# EAGLE design nrf52840_holyiot_18010_breakout_rev_1 (EAGLE 9.2.1)
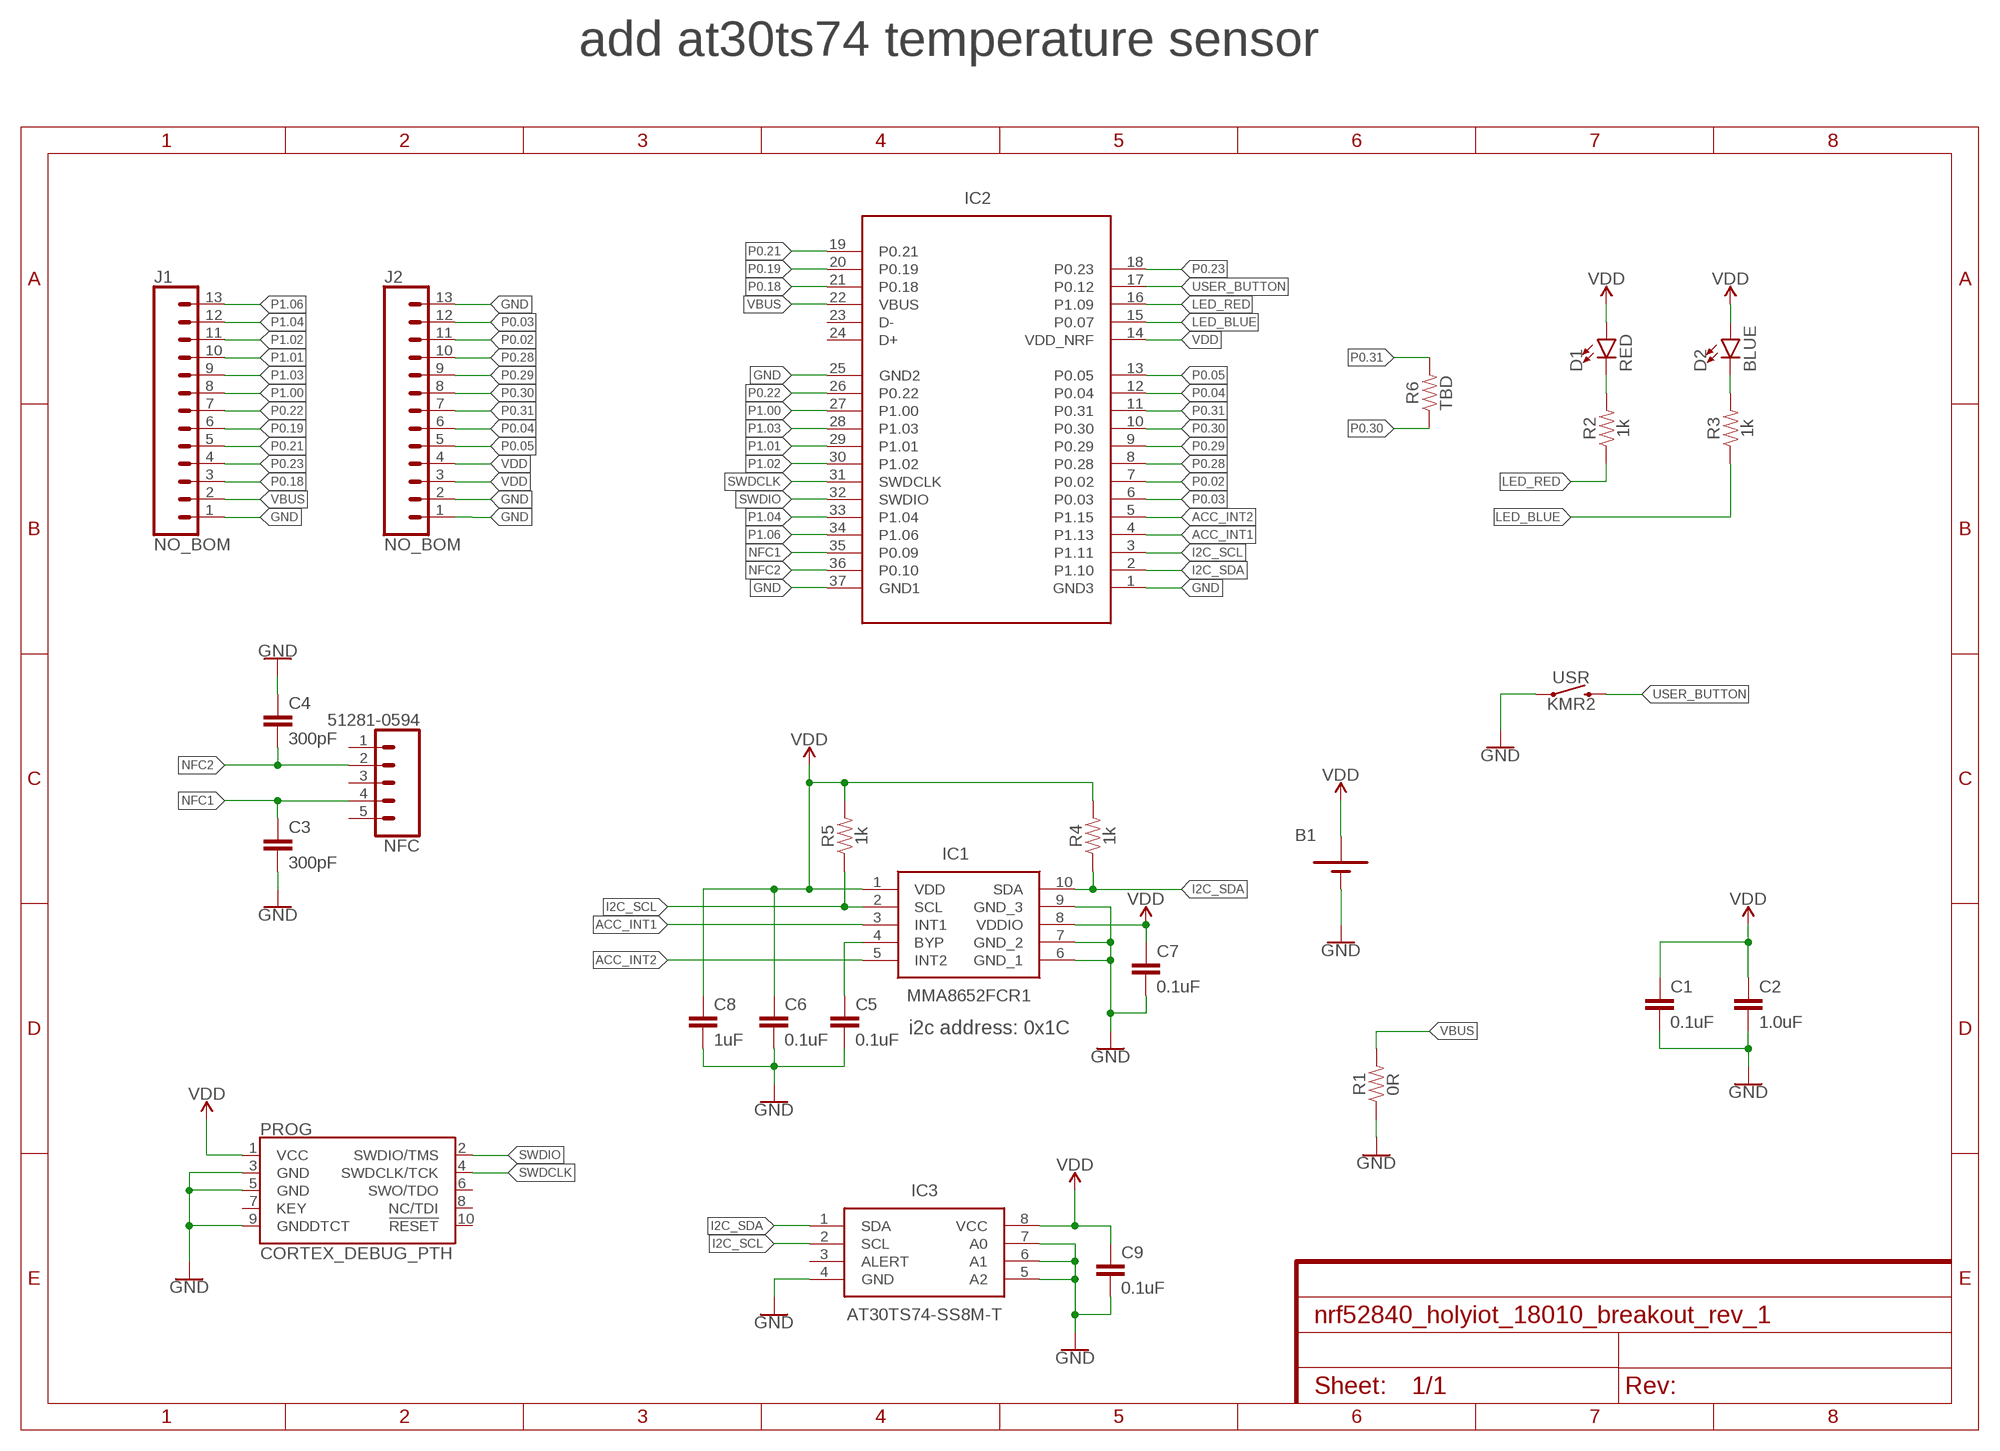
[diagram p0: schematic, sheet 1]

## Parts
B1  BATTERY-BU2032  [BU2032SM-HD-G]
C1  0.1uF  CAP-6.3V-20%-0402  [C0402]
C2  1.0uF  CAP-6.3V-20%-0603  [C0603]
C3  300pF  CAP-6.3V-20%-0402  [C0402]
C4  300pF  CAP-6.3V-20%-0402  [C0402]
C5  0.1uF  CAP-6.3V-20%-0402  [C0402]
C6  0.1uF  CAP-6.3V-20%-0402  [C0402]
C7  0.1uF  CAP-6.3V-20%-0402  [C0402]
C8  1uF  CAP-6.3V-20%-0402  [C0402]
C9  0.1uF  CAP-6.3V-20%-0402  [C0402]
D1  RED  LED0603  [LED-0603]
D2  BLUE  LED0603  [LED-0603]
IC1  MMA8652FCR1  [SON40P200X200X100-10N]
IC2  HOLYIOT_18010  [HOLYIOT_18010_REDUCED]
IC3  AT30TS74-SS8M-T  [SOIC127P600X175-8N]
J1  NO_BOM  CONN_13NO_SILK  [1X13_NO_SILK]
J2  NO_BOM  CONN_13NO_SILK  [1X13_NO_SILK]
NFC  51281-0594  [51281-0594]
PROG  CORTEX_DEBUG_PTH  [2X5-PTH-1.27MM]
R1  0R  RES-0.063W-5%-0402  [R0402]
R2  1k  RES-0.063W-5%-0402  [R0402]
R3  1k  RES-0.063W-5%-0402  [R0402]
R4  1k  RES-0.063W-5%-0402  [R0402]
R5  1k  RES-0.063W-5%-0402  [R0402]
R6  TBD  RES-0.063W-1%-0402  [R0402]
USR  KMR2  [TACTILE_SWITCH_SMD_4.6X2.8MM]

## Nets
ACC_INT1: IC1.3(INT1) IC2.4(P1.13)
ACC_INT2: IC1.5(INT2) IC2.5(P1.15)
GND: B1.2(-) C1.2 C2.2 C3.2 C4.1 C5.2 C6.2 C7.2 C8.2 C9.2 IC1.6(GND_1) IC1.7(GND_2) IC1.9(GND_3) IC2.1(GND3) IC2.25(GND2) IC2.37(GND1) IC3.4(GND) IC3.5(A2) IC3.6(A1) IC3.7(A0) J1.1 J2.1 J2.2 J2.13 PROG.3(GND) PROG.5(GND) PROG.9(GNDDTCT) R1.1 USR.1 USR.2
I2C_SCL: IC1.2(SCL) IC2.3(P1.11) IC3.2(SCL) R5.1
I2C_SDA: IC1.10(SDA) IC2.2(P1.10) IC3.1(SDA) R4.1
LED_BLUE: IC2.15(P0.07) R3.1
LED_RED: IC2.16(P1.09) R2.1
N$1: D1.C R2.2
N$2: D2.C R3.2
N$3: C5.1 IC1.4(BYP)
NFC1: C3.1 IC2.35(P0.09) NFC.4
NFC2: C4.2 IC2.36(P0.10) NFC.2
P0.02: IC2.7(P0.02) J2.11
P0.03: IC2.6(P0.03) J2.12
P0.04: IC2.12(P0.04) J2.6
P0.05: IC2.13(P0.05) J2.5
P0.18: IC2.21(P0.18) J1.3
P0.19: IC2.20(P0.19) J1.6
P0.21: IC2.19(P0.21) J1.5
P0.22: IC2.26(P0.22) J1.7
P0.23: IC2.18(P0.23) J1.4
P0.28: IC2.8(P0.28) J2.10
P0.29: IC2.9(P0.29) J2.9
P0.30: IC2.10(P0.30) J2.8 R6.1
P0.31: IC2.11(P0.31) J2.7 R6.2
P1.00: IC2.27(P1.00) J1.8
P1.01: IC2.29(P1.01) J1.10
P1.02: IC2.30(P1.02) J1.11
P1.03: IC2.28(P1.03) J1.9
P1.04: IC2.33(P1.04) J1.12
P1.06: IC2.34(P1.06) J1.13
SWDCLK: IC2.31(SWDCLK) PROG.4(SWDCLK/TCK)
SWDIO: IC2.32(SWDIO) PROG.2(SWDIO/TMS)
USER_BUTTON: IC2.17(P0.12) USR.3 USR.4
VBUS: IC2.22(VBUS) J1.2 R1.2
VDD: B1.1(+) C1.1 C2.1 C6.1 C7.1 C8.1 C9.1 D1.A D2.A IC1.1(VDD) IC1.8(VDDIO) IC2.14(VDD_NRF) IC3.8(VCC) J2.3 J2.4 PROG.1(VCC) R4.2 R5.2
Unconnected: IC2.23(D-) IC2.24(D+) IC3.3(ALERT) NFC.1 NFC.3 NFC.5 PROG.6(SWO/TDO) PROG.7(KEY) PROG.8(NC/TDI) PROG.10(!RESET)

## Notes on the sheet
- add at30ts74 temperature sensor
- i2c address: 0x1C

## Library data of the parts
B1 = Inventas-Misc:BATTERY: 596: https://www.digikey.com/product-detail/en/keystone-electronics/596/36-596-ND/2137852 590: https://www.digikey.com/product-detail/en/keystone-electronics/590/36-590-ND/2137886 5230: https://www.digikey.com/product-detail/en/keystone-electronics/5230/36-5230-ND/643095; MANUFACTURER_NAME: MPD; MANUFACTURER_PART_NUMBER: BU2032SM-HD-G
C1-C9 = Inventas-Passives:CAP-6.3V-20%: Ceramic capacitors
D1 D2 = inventas_LEDs:LED: LED (Generic) Standard schematic elements and footprints for 5mm, 3mm, 1206, and 0603 sized LEDs. Generic LEDs with no color specified.
IC1 = Inventas-IC:MMA8652FCR1: NXP MMA8652FCR1, 3-Axis Accelerometer, 2 g, 4 g, 8 g, 1.95 3.6 V, Serial-I2C, DFN 10-Pin Source: Datasheet <https://cache.freescale.com/files/sensors/doc/data_sheet/MMA8652FC.pdf>; ARROW_PART_NUMBER: MMA8652FCR1; ARROW_PRICE-STOCK: http://uk.rs-online.com/web/p/products/8016889P; DESCRIPTION: NXP MMA8652FCR1, 3-Axis Accelerometer, 2 g, 4 g, 8 g, 1.95 3.6 V, Serial-I2C, DFN 10-Pin; HEIGHT: 1mm; MANUFACTURER_NAME: NXP; MANUFACTURER_PART_NUMBER: MMA8652FCR1; RS_PART_NUMBER: 8016889P; RS_PRICE-STOCK: http://uk.rs-online.com/web/p/products/8016889P
IC2 = Inventas-IC:HOLYIOT_18010; MANUFACTURER_NAME: Holyiot; MANUFACTURER_PART_NUMBER: 18010
IC3 = Inventas-IC:AT30TS74; MANUFACTURER_NAME: microchip; MANUFACTURER_PART_NUMBER: AT30TS74-SS8M-T
J1 J2 = Inventas-Connectors:CONN_13: Multi connection point. Often used as Generic Header-pin footprint for 0.1 inch spaced/style header connections On any of the 0.1 inch spaced packages, you can populate with these: Break Away Headers - Straight <https://www.sparkfun.com/products/116> (PRT-00116) Break Away Male Headers - Right Angle <https://www.sparkfun.com/products/553> (PRT-00553) Female Headers <https://www.sparkfun.com/products/115> (PRT-00115) Break Away Headers - Machine Pin <https://www.sparkfun.com/products/117> (PRT-00117) Break Away Female Headers - Swiss Machine Pin <https://www.sparkfun.com/products/743> (PRT-00743) For SCREWTERMINALS and SPRING TERMINALS visit here: Screw Terimnals on SparkFun.com <https://www.sparkfun.com/search/results?term=Screw+Terminals> (5mm/3.5mm/2.54mm spacing) This device is also useful as a general connection point to wire up your design to another part of your project. Our various solder wires solder well into these plated through hole pads. Hook-Up Wire - Assortment (Stranded, 22 AWG) <https://www.sparkfun.com/products/11375> (PRT-11375) Hook-Up Wire - Assortment (Solid Core, 22 AWG) <https://www.sparkfun.com/products/11367> (PRT-11367) View the entire wire category on our website here <https://www.sparkfun.com/categories/141> Special notes: Molex polarized connector foot print use with SKU : PRT-08231 with associated crimp pins and housings. 1MM SMD Version SKU: PRT-10208 NOTES ON THE VARIANTS LOCK and LOCK_LONGPADS... This footprint was designed to help hold the alignment of a through-hole component (i.e. 6-pin header) while soldering it into place. You may notice that each hole has been shifted either up or down by 0.005 of an inch from it's more standard position (which is a perfectly straight line). This slight alteration caused the pins (the squares in the middle) to touch the edges of the holes. Because they are alternating, it causes a "brace" to hold the component in place. 0.005 has proven to be the perfect amount of "off-center" position when using our standard breakaway headers. Although looks a little odd when you look at the bare footprint, once you have a header in there, the alteration is very hard to notice. Also,if you push a header all the way into place, it is covered up entirely on the bottom side.
NFC = Inventas-Connectors:51281-0594: FFC & FPC Connectors 0.5 FPC Non-ZIF 5Ckt Dual Contact Source: Datasheet <http://www.molex.com/pdm_docs/sd/512810594_sd.pdf>; DESCRIPTION: FFC & FPC Connectors 0.5 FPC Non-ZIF 5Ckt Dual Contact; HEIGHT: mm; MANUFACTURER_NAME: Molex; MANUFACTURER_PART_NUMBER: 51281-0594; SUPPLIER_NAME: RS
PROG = Inventas-Connectors:CORTEX_DEBUG: Cortex Debug Connector - 10 pin Supports JTAG debug, Serial Wire debug, and Serial Wire Viewer. PTH and SMD connector options available. General Connector Information <http://infocenter.arm.com/help/topic/com.arm.doc.faqs/attached/13634/cortex_debug_connectors.pdf> Products: PTH Connector <http://www.digikey.com/product-detail/en/cnc-tech/3220-10-0100-00/1175-1627-ND/3883661> -via Digi-Key SparkFun PSoc <https://www.sparkfun.com/products/13229> SparkFun T <https://www.sparkfun.com/products/13810>
R1-R5 = Inventas-Passives:RES-0.063W-5%-: Generic Resistor Package
R6 = Inventas-Passives:RES-0.063W-1%-: Generic Resistor Package
USR = Inventas-Buttons:KMR2; MANUFACTURER_NAME: C&K; MANUFACTURER_PART_NUMBER: KMR211GLFS

## Board
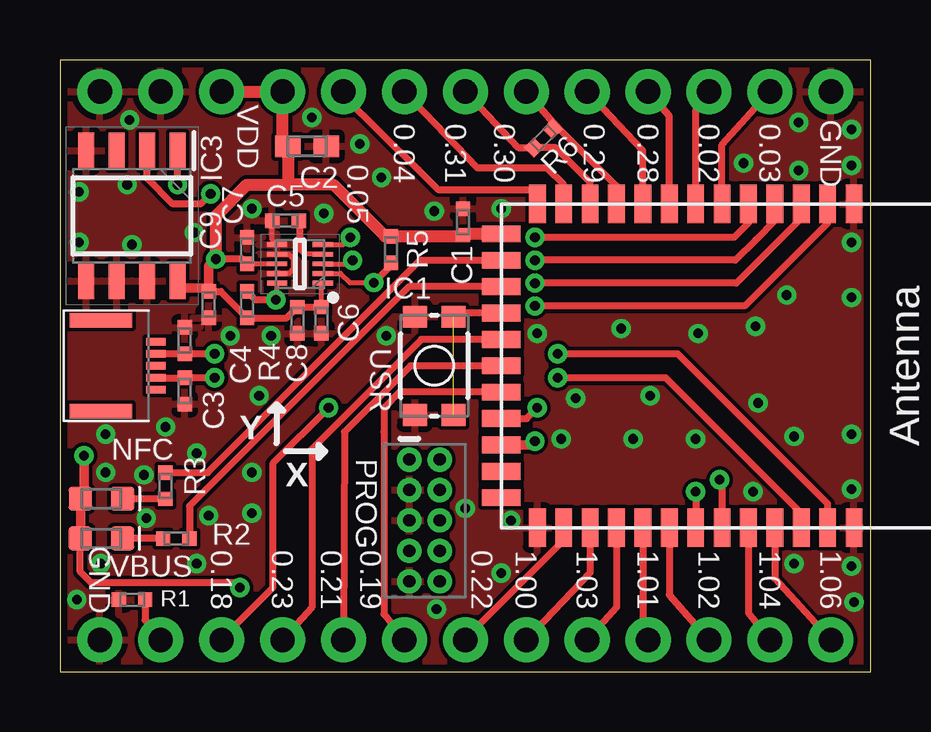
[diagram p1: board, top side]
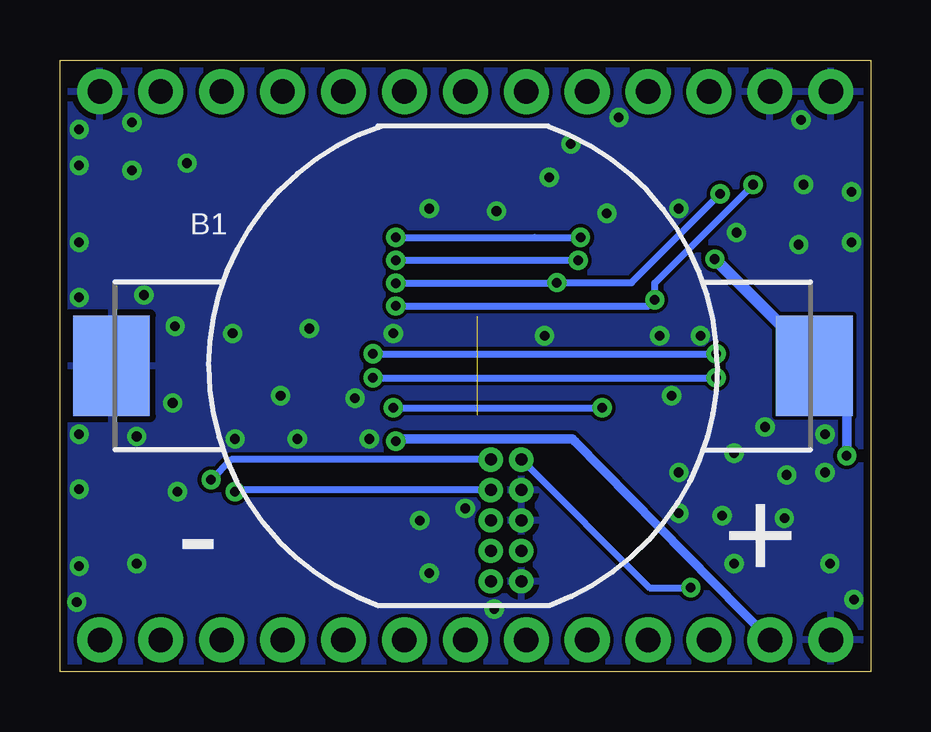
[diagram p2: board, bottom side, seen from below]

Size 33.8 x 25.5 mm. Coordinates in mm from the lower left corner, seen from the top.
Outline: 0,0 33.8,0 33.8,25.5 0,25.5 0,0
Copper layers (1*16): Top 0.035mm / dielectric 1.5mm / Bottom 0.035mm
Design rules "Elecrow_2-layer_eagle_rule *": minimum track width 6mil, minimum drill 12mil, track to track 6mil, track to pad 6mil, pad to pad 6mil, via to via 6mil, smd to smd 0mil, copper to edge 0.3mm, drill to drill 0.3mm, minimum pad ring 10mil, minimum via ring 6mil, stop-mask expansion 2mil, vias tented up to drill 100mil, thermal gap 10mil

### Footprints (pad centres in the part's own frame; a part is rotated, then mirrored left to right if it is on the bottom)
BU2032SM-HD-G = smd 3.2 x 4.2: 1 -14.65,0; 2 14.65,0
C0402 = smd 0.6 x 0.6: 1 -0.55,0; 2 0.55,0
C0603 = smd 1.05 x 0.9: 1 -0.8,0; 2 0.8,0
LED-0603 = smd 1 x 1: A 0.877,0; C -0.877,0
SON40P200X200X100-10N = smd 0.85 x 0.2: 1 -0.95,0.8; 2 -0.95,0.4; 3 -0.95,0; 4 -0.95,-0.4; 5 -0.95,-0.8; 6 0.95,-0.8; 7 0.95,-0.4; 8 0.95,0; 9 0.95,0.4; 10 0.95,0.8
HOLYIOT_18010_REDUCED = smd 1.6 x 0.7: 1 -6.75,5.7; 2 -6.75,4.6; 3 -6.75,3.5; 4 -6.75,2.4; 5 -6.75,1.3; 6 -6.75,0.2; 7 -6.75,-0.9; 8 -6.75,-2; 9 -6.75,-3.1; 10 -6.75,-4.2; 11 -6.75,-5.3; 12 -6.75,-6.4; 13 -6.75,-7.5; 25 6.75,-7.5; 26 6.75,-6.4; 27 6.75,-5.3; 28 6.75,-4.2; 29 6.75,-3.1; 30 6.75,-2; 31 6.75,-0.9; 32 6.75,0.2; 33 6.75,1.3; 34 6.75,2.4; 35 6.75,3.5; 36 6.75,4.6; 37 6.75,5.7 | smd 0.7 x 1.6: 14 -5.5,-9; 15 -4.4,-9; 16 -3.3,-9; 17 -2.2,-9; 18 -1.1,-9; 19 0,-9; 20 1.1,-9; 21 2.2,-9; 22 3.3,-9; 23 4.4,-9; 24 5.5,-9
SOIC127P600X175-8N = smd 1.525 x 0.65: 1 -2.712,1.905; 2 -2.712,0.635; 3 -2.712,-0.635; 4 -2.712,-1.905; 5 2.712,-1.905; 6 2.712,-0.635; 7 2.712,0.635; 8 2.712,1.905
1X13_NO_SILK = drill 1.016 pad 1.88: 1 -15.24,0; 2 -12.7,0; 3 -10.16,0; 4 -7.62,0; 5 -5.08,0; 6 -2.54,0; 7 0,0; 8 2.54,0; 9 5.08,0; 10 7.62,0; 11 10.16,0; 12 12.7,0; 13 15.24,0
51281-0594 = smd 0.3 x 0.8: 1 -1,0; 2 -0.5,0; 3 0,0; 4 0.5,0; 5 1,0 | smd 0.6 x 2.6: 6 -1.9,-2.3; 7 1.9,-2.3
2X5-PTH-1.27MM = drill 0.508 pad 1: 1 -2.54,-0.635; 2 -2.54,0.635; 3 -1.27,-0.635; 4 -1.27,0.635; 5 0,-0.635; 6 0,0.635; 7 1.27,-0.635; 8 1.27,0.635; 9 2.54,-0.635; 10 2.54,0.635
R0402 = smd 0.6 x 0.6: 1 -0.55,0; 2 0.55,0
TACTILE_SWITCH_SMD_4.6X2.8MM = smd 0.9 x 1: 1 -2.05,-0.8; 2 2.05,-0.8; 3 2.05,0.8; 4 -2.05,0.8

### Placement (x,y rotation side)
B1  17,12.75 180 bottom
C1  16.8,18.75 90 top
C2  10.3,21.9 0 top
C3  5.2,11.7 270 top
C4  5.2,13.8 270 top
C5  9.4,18.8 180 top
C6  10.9,14.65 270 top
C7  7.8,17.55 90 top
C8  9.9,14.65 270 top
C9  6.2,15.3 270 top
D1  1.72,5.55 180 top
D2  1.73,7.21 180 top
IC1  10,17 180 top
IC2  27.4,12.75 270 top
IC3  3,19 270 top
J1  16.9,1.32 180 bottom
J2  16.9,24.18 180 bottom
NFC  4,12.75 270 top
PROG  15.2,6.3 270 top
R1  3,3 0 top
R2  4.85,5.55 180 top
R3  4.4,7.75 270 top
R4  7.8,15.3 270 top
R5  13.8,17.6 90 top
R6  20.15,22.23 225 top
USR  15.6,12.75 270 top

### Tracks (layer width: path | path; a pad name or v marks a point on that pad's centre or on a via)
ACC_INT1  (via drill 0.4 pad 0.8)
  Top 0.2: IC1.3 12.05,17 v12.2,17.15
  Top 0.3: IC2.4 29.8,18.8 29,18 28.15,17.15 v19.8,17.15
  Bottom 0.3: v19.8,17.15 v12.2,17.15
ACC_INT2  (via drill 0.4 pad 0.8)
  Top 0.2: IC1.5 11.8,17.8 v12.1,18.1
  Top 0.3: IC2.5 28.7,18.7 28.1,18.1 v19.8,18.1
  Bottom 0.3: v19.8,18.1 14,18.1 v12.1,18.1
GND  (via drill 0.4 pad 0.8)
  Top 0.2: IC1.6 8.85,18 C5.2 | IC1.7 9.53,17.4 9.73,17.2 9.73,16.8 9.53,16.6 IC1.9
  other vias: 10.5,23.1 12.5,22 13.4,20.6 11,19.1 8,19.3 8.8,14 7.1,14 13.6,14 15.6,19.2 18.4,19.3 5.6,18.3 1.9,9.9 1.9,8.3 3.5,8.2 4.4,10.2 5.7,9.1 8.3,11.5 8,8.3 8,6.6 6.2,6.5 5.7,4.5 1.7,4.5 3.6,6.4 16.9,6.8 18.8,6.3 18.4,4.1 15.7,2.6 30.6,4.5 33.1,2.9 33,4.4 33,7.6 33,9.9 33,15.6 33,17.9 30.3,15.7 30.6,9.8 29.1,11.2 29,14.4 26.6,14.1 23.4,14.3 19.9,14.1 21.5,11.4 20.9,9.7 26.5,9.7 23.9,9.7 24.6,11.5 28.9,7.5 0.7,3 0.8,20 0.8,17.9 3,17.8 2.8,20.3 2.9,23 28.5,21.2 30.8,22.9 30.8,20.9 33,21.1 33,22.6
  pour Top: -9,29 39,29 41,27 41,1 34,-6 -9,-6 -14,-1 -14,24
  pour Bottom: -15,34 44,34 49,29 49,1 36,-12 -13,-12 -20,-5 -20,29
I2C_SCL  (via drill 0.4 pad 0.8)
  Top 0.2: IC1.2 11.7,16.6 12.08,16.22 v13.08,16.22
  Top 0.3: IC2.3 30.9,18.9 28.2,16.2 v19.8,16.2 | v13.08,16.22 13.8,16.93 R5.1 | v6.28,19.91 5.87,19.5 4.71,19.5 3.63,20.57 IC3.2
  Bottom 0.3: v19.8,16.2 15,16.2 13.11,16.2 v13.08,16.22 9.98,16.22 v6.28,19.91
I2C_SDA  (via drill 0.4 pad 0.8)
  Top 0.2: v9,15.5 9.05,15.55 IC1.10
  Top 0.3: IC2.2 32,18.7 28.54,15.24 v19.8,15.24 | v4.9,20.3 v4.91,20.3 IC3.1 | v9,15.5 8.15,15.5 R4.1
  Bottom 0.3: v19.8,15.24 9.26,15.24 v9,15.5 9,16.2 v4.9,20.3
LED_BLUE
  Top 0.3: R3.1 6.16,8.3 15.01,17.15 IC2.15
LED_RED
  Top 0.3: IC2.16 14.55,16.05 5.4,6.9 R2.1
N$1
  Top 0.3: R2.2 | R2.2 D1.C
N$2
  Top 0.3: R3.2 D2.C
N$3
  Top 0.2: IC1.4 10.2,17.4 10,17.6
  Top 0.3: 10,17.6 10,18.75 C5.1
NFC1  (via drill 0.4 pad 0.8)
  Top 0.3: IC2.35 30.9,6.6 25.25,12.25 v20.75,12.25 | NFC.4 C3.1 v6.45,12.25
  Bottom 0.3: v20.75,12.25 v6.45,12.25
NFC2  (via drill 0.4 pad 0.8)
  Top 0.3: IC2.36 32,7 25.75,13.25 v20.75,13.25 | v6.45,13.25 C4.2 NFC.2
  Bottom 0.3: v20.75,13.25 v6.45,13.25
P0.02
  Top 0.3: IC2.7 26.5,23.4 J2.11
P0.03
  Top 0.3: IC2.6 27.6,21.96 J2.12
P0.04
  Top 0.3: IC2.12 21,20.3 20.3,21 17.4,21 J2.6
P0.05
  Top 0.3: J2.5 11.83,24 14.93,20.93 15.76,20.1 19.9,20.1 IC2.13
P0.18  (via drill 0.4 pad 0.8)
  Top 0.3: IC2.21 19.45,10.55 v19.9,11 | v11.2,11 8.87,8.67 8.87,3.5 6.87,1.5 J1.3
  Bottom 0.3: v19.9,11 v11.2,11
P0.19
  Top 0.3: IC2.20 14.15,11.65 13.5,11 13.5,10 13.5,2.4 J1.6
P0.21
  Top 0.3: J1.5 11.86,10 14.61,12.75 IC2.19
P0.22
  Top 0.3: IC2.26 21,5.5 17,1.5 J1.7
P0.23
  Top 0.3: IC2.18 15.07,13.85 10.5,9.28 10.5,2.68 J1.4
P0.28
  Top 0.3: IC2.8 25.4,23.16 J2.10
P0.29
  Top 0.3: IC2.9 24.3,21.72 J2.9
P0.30
  Top 0.3: J2.8 20.72,22.72 | 20.72,22.72 23.2,20.24 IC2.10 | R6.1 20.64,22.72 20.72,22.72
P0.31
  Top 0.3: IC2.11 22.1,20.4 20.66,21.84 R6.2 19.1,21.84 J2.7
P1.00
  Top 0.3: IC2.27 22.1,4.12 J1.8
P1.01
  Top 0.3: IC2.29 24.3,1.76 J1.10
P1.02
  Top 0.3: IC2.30 25.4,3.2 J1.11
P1.03
  Top 0.3: IC2.28 23.2,2.68 J1.9
P1.04
  Top 0.3: IC2.33 28.7,2.44 J1.12
P1.06
  Top 0.3: IC2.34 29.8,3.88 J1.13
SWDCLK  (via drill 0.4 pad 0.8)
  Top 0.3: v26.5,7.5 IC2.31
  Bottom 0.3: PROG.4 26.43,7.57 v26.5,7.5
SWDIO  (via drill 0.4 pad 0.8)
  Top 0.3: v27.5,8 27.6,7.9 IC2.32
  Bottom 0.3: PROG.2 26.66,8.84 v27.5,8
USER_BUTTON  (1 unrouted)
  Top 0.3: IC2.17 16.55,14.95 USR.4
VBUS  (via drill 0.4 pad 0.8)
  Top 0.3: R1.2 3.55,2.15 J1.2
  Top 0.4: IC2.22 19.65,9.45 v19.8,9.6
  Bottom 0.4: J1.2 12.34,9.6 12.44,9.7 19.7,9.7 v19.8,9.6
VDD  (via drill 0.4 pad 0.8)
  Top 0.2: C6.1 10.9,16.15 IC1.1 | IC1.8 C7.1
  Top 0.3: v7.5,3.5 7.3,3.7 1.3,3.7 0.85,4.15 D1.A | C9.1 6.7,15.85 R4.2 9.45,14.75 C8.1 C6.1 | C7.1 7.6,17.2 v6.5,17.2
  Top 0.4: D1.A D2.A 1,7.35 v1,9 | v6.5,17.2 6.2,16.9 6.2,16 | 6.2,16 C9.1 | IC3.8 5.19,16 6.2,16
  Top 0.5: v6.5,17.2 6.5,19 7.8,20.3 9.5,20.3 | J2.3 J2.4 9.28,22.12 C2.1 9.5,20.3 | IC2.14 16.85,18.25 C1.1 16.75,18.15 R5.2 13.55,18.15 11.4,20.3 9.5,20.3
  Bottom 0.3: PROG.1 9.22,3.5 v7.5,3.5
  Bottom 0.4: v1,9 1,11.4 B1.1
  Bottom 0.5: B1.1 2.35,13.05 v6.5,17.2

### Text on the board
tPlace: VDD | 0.04 | 0.31 | 0.30 | 0.29 | 0.28 | 0.02 | 0.03 | GND | 0.05 | Y | X | GND | VBUS | 0.18 | 0.23 | 0.21 | 0.19 | 0.22 | 1.00 | 1.03 | 1.01 | 1.02 | 1.04 | 1.06